# Altium schematic sheet MCP73831 Li-Ion charge.SchDoc: Li-Ion charge
size A4; Date: 08.05.2016; Author: Pavel Nadein; DocumentName: Li-Ion charge
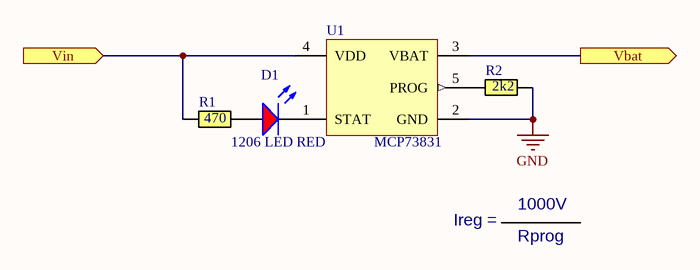
[diagram p0: MCP73831 Li-Ion charge.SchDoc]

## Parts
D1  1206 LED RED  [1206 LED RED]
R1  470  [RESC0603(1608)_N]
R2  2k2  [RESC0603(1608)_N]
U1  MCP73831  [SOT23-5]

## Ports
Vbat (out), Vin (in)

## Nets
GND: R2.2 U1.2(GND)
Vbat: U1.3(VBAT) ; port Vbat
Vin: R1.1 U1.4(VDD) ; port Vin
NetD1_A: D1.A R1.2
NetD1_K: D1.K U1.1(STAT)
NetR2_1: R2.1 U1.5(PROG)

## Notes on the sheet
- Ireg =
- 1000V
- Rprog

## Library data of the parts
R1 R2 = Resistor M: Resistor Medium Density
  R1: Value: 470
  R2: Value: 2k2
U1 = MCP73831: Linear Charge Management Controller; Supply Voltage: 3.75 ~ 6V